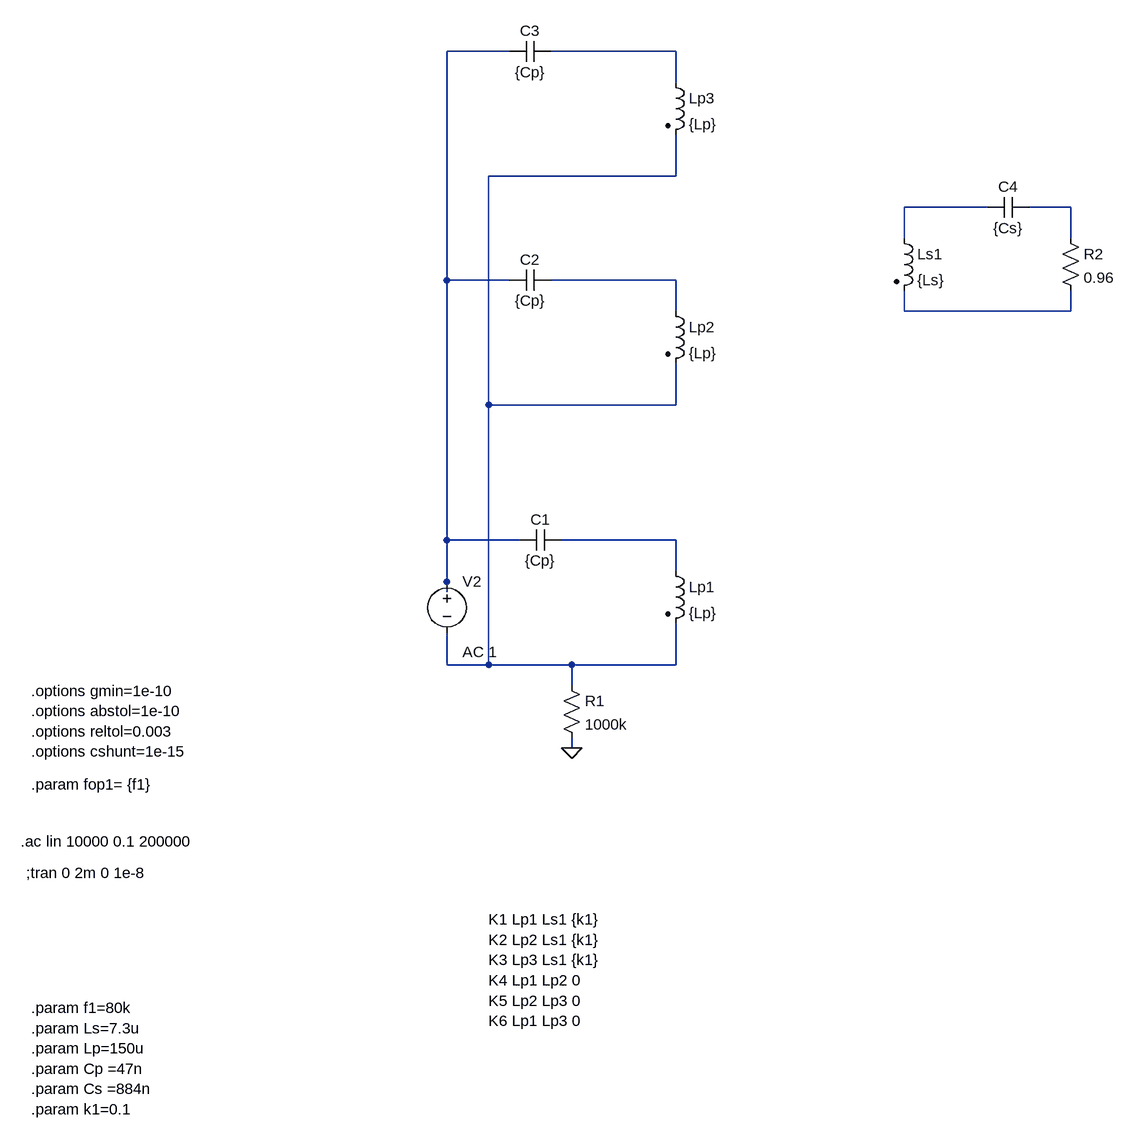
[diagram p0: schematic 1Tx2Rx_sine - Copy.asc]
1Tx2Rx_sine - Copy.asc, the LTspice schematic file:
Version 4
SHEET 1 3864 3572
WIRE 944 -160 848 -160
WIRE 1200 -160 1008 -160
WIRE 1200 -112 1200 -160
WIRE 1200 32 1200 -32
WIRE 1200 32 912 32
WIRE 1680 80 1552 80
WIRE 1808 80 1744 80
WIRE 1552 128 1552 80
WIRE 1808 128 1808 80
WIRE 848 192 848 -160
WIRE 944 192 848 192
WIRE 1200 192 1008 192
WIRE 1200 240 1200 192
WIRE 1552 240 1552 208
WIRE 1808 240 1808 208
WIRE 1808 240 1552 240
WIRE 912 384 912 32
WIRE 1200 384 1200 320
WIRE 1200 384 912 384
WIRE 848 592 848 192
WIRE 960 592 848 592
WIRE 1200 592 1024 592
WIRE 1200 640 1200 592
WIRE 848 656 848 592
WIRE 848 672 848 656
WIRE 848 784 848 736
WIRE 912 784 912 384
WIRE 912 784 848 784
WIRE 1040 784 912 784
WIRE 1200 784 1200 720
WIRE 1200 784 1040 784
WIRE 1040 816 1040 784
WIRE 1040 912 1040 896
FLAG 1040 912 0
SYMBOL ind2 1184 624 R0
SYMATTR InstName Lp1
SYMATTR Value {Lp}
SYMATTR Type ind
SYMBOL ind2 1536 112 R0
SYMATTR InstName Ls1
SYMATTR Value {Ls}
SYMATTR Type ind
SYMBOL res 1792 112 R0
SYMATTR InstName R2
SYMATTR Value 0.96
SYMBOL voltage 848 640 R0
WINDOW 123 24 124 Left 2
WINDOW 39 0 0 Left 0
SYMATTR Value2 AC 1
SYMATTR InstName V2
SYMATTR Value ""
SYMBOL ind2 1184 224 R0
SYMATTR InstName Lp2
SYMATTR Value {Lp}
SYMATTR Type ind
SYMBOL ind2 1184 -128 R0
SYMATTR InstName Lp3
SYMATTR Value {Lp}
SYMATTR Type ind
SYMBOL cap 1024 576 R90
WINDOW 0 0 32 VBottom 2
WINDOW 3 32 32 VTop 2
SYMATTR InstName C1
SYMATTR Value {Cp}
SYMBOL cap 1008 176 R90
WINDOW 0 0 32 VBottom 2
WINDOW 3 32 32 VTop 2
SYMATTR InstName C2
SYMATTR Value {Cp}
SYMBOL cap 1008 -176 R90
WINDOW 0 0 32 VBottom 2
WINDOW 3 32 32 VTop 2
SYMATTR InstName C3
SYMATTR Value {Cp}
SYMBOL res 1024 800 R0
SYMATTR InstName R1
SYMATTR Value 1000k
SYMBOL cap 1744 64 R90
WINDOW 0 0 32 VBottom 2
WINDOW 3 32 32 VTop 2
SYMATTR InstName C4
SYMATTR Value {Cs}
TEXT 200 1104 Left 2 !;tran 0 2m 0 1e-8
TEXT 208 1312 Left 2 !.param f1=80k  \n.param Ls=7.3u\n.param Lp=150u\n.param Cp =47n\n.param Cs =884n\n.param k1=0.1
TEXT 192 1056 Left 2 !.ac lin 10000 0.1 200000
TEXT 208 968 Left 2 !.param fop1= {f1}
TEXT 208 824 Left 2 !.options gmin=1e-10   \n.options abstol=1e-10  \n.options reltol=0.003  \n.options cshunt=1e-15
TEXT 912 1176 Left 2 !K1 Lp1 Ls1 {k1}\nK2 Lp2 Ls1 {k1}\nK3 Lp3 Ls1 {k1}\nK4 Lp1 Lp2 0\nK5 Lp2 Lp3 0\nK6 Lp1 Lp3 0

The netlist it stands for:
* 1Tx2Rx_sine - Copy.asc
Lp1 N008 N003 {Lp}
Ls1 N004 N007 {Ls}
R2 N005 N007 0.96
V2 N001 N003 AC 1
Lp2 N006 N003 {Lp}
Lp3 N002 N003 {Lp}
C1 N008 N001 {Cp}
C2 N006 N001 {Cp}
C3 N002 N001 {Cp}
R1 N003 0 1000k
C4 N005 N004 {Cs}
;tran 0 2m 0 1e-8
.param f1=80k
.param Ls=7.3u
.param Lp=150u
.param Cp =47n
.param Cs =884n
.param k1=0.1
.ac lin 10000 0.1 200000
.param fop1= {f1}
.options gmin=1e-10
.options abstol=1e-10
.options reltol=0.003
.options cshunt=1e-15
K1 Lp1 Ls1 {k1}
K2 Lp2 Ls1 {k1}
K3 Lp3 Ls1 {k1}
K4 Lp1 Lp2 0
K5 Lp2 Lp3 0
K6 Lp1 Lp3 0
.backanno
.end